# Altium schematic sheet ESP32_Interface.SchDoc
size A4; SheetNumber: 1; SheetTotal: 4
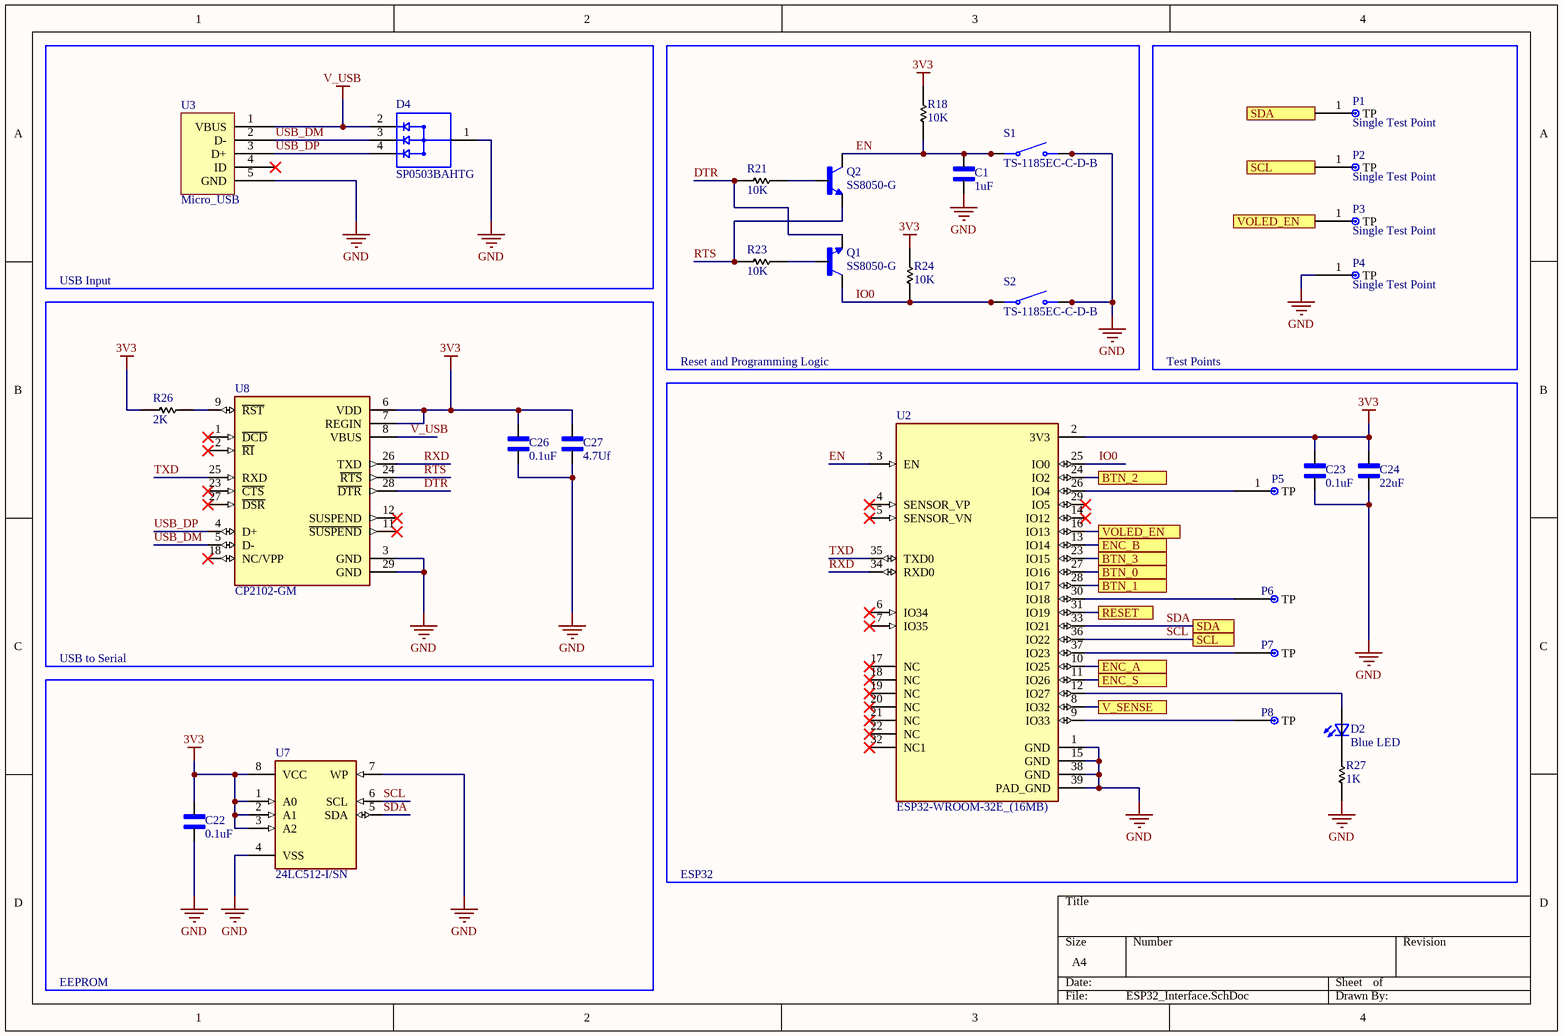
[diagram p0: ESP32_Interface.SchDoc]

## Parts
C1  1uF  [CHIP_0603]
C22  0.1uF  [CHIP_0603]
C23  0.1uF  [CHIP_0603]
C24  22uF  [CHIP_0603]
C26  0.1uF  [CHIP_0603]
C27  4.7Uf  [CHIP_0603]
D2  Blue LED  [0603 LED Generic]
D4  SP0503BAHTG  [SP0503BAHTG]
P1  Single Test Point  [1 Solder Pad]
P2  Single Test Point  [1 Solder Pad]
P3  Single Test Point  [1 Solder Pad]
P4  Single Test Point  [1 Solder Pad]
P5  Single Test Point  [1 Solder Pad]  (value not drawn)
P6  Single Test Point  [1 Solder Pad]  (value not drawn)
P7  Single Test Point  [1 Solder Pad]  (value not drawn)
P8  Single Test Point  [1 Solder Pad]  (value not drawn)
Q1  SS8050-G  [SS8050-G]
Q2  SS8050-G  [SS8050-G]
R18  10K  [CHIP_R_0603]
R21  10K  [CHIP_R_0603]
R23  10K  [CHIP_R_0603]
R24  10K  [CHIP_R_0603]
R26  2K  [CHIP_R_0603]
R27  1K  [CHIP_R_0603]
S1  TS-1185EC-C-D-B  [TS-1185EC-C-D-B]
S2  TS-1185EC-C-D-B  [TS-1185EC-C-D-B]
U2  ESP32-WROOM-32E_(16MB)  [MODULE_ESP32-WROOM-32E]
U3  Micro_USB  [U254-051T-4BH83-F1S]
U7  24LC512-I/SN  [24LC512-I/SN]
U8  CP2102-GM  [QFN50P500X500X100-29N]

## Blocks framed on the sheet
USB Input: D4 U3
Reset and Programming Logic: C1 Q1 Q2 R18 R21 R23 R24 S1 S2
Test Points: P1-P4
USB to Serial: C26 C27 R26 U8
ESP32: C23 C24 D2 P5-P8 R27 U2

## Ports
BTN_0, BTN_1, BTN_2, BTN_3, ENC_A, ENC_B, ENC_S, RESET, SCL, SDA, V_SENSE, VOLED_EN

## Nets
3V3: C22.1 C23.1 C24.1 C26.1 C27.1 R18.1 R24.1 R26.2 U2.2(3V3) U7.1(A0) U7.2(A1) U7.3(A2) U7.8(VCC) U8.6(VDD) U8.7(REGIN)
GND: C1.2 C22.2 C23.2 C24.2 C26.2 C27.2 D4.1 P4.1(TP) R27.2 S1.3(NO) S1.4(NO) S2.3(NO) S2.4(NO) U2.1(GND) U2.15(GND) U2.38(GND) U2.39(PAD_GND) U3.5(GND) U7.4(VSS) U7.7(WP) U8.3(GND) U8.29(GND)
V_USB: D4.2 U3.1(VBUS) U8.8(VBUS)
BTN_0: U2.27(IO16) ; port BTN_0
BTN_1: U2.28(IO17) ; port BTN_1
BTN_2: U2.24(IO2) ; port BTN_2
BTN_3: U2.23(IO15) ; port BTN_3
DTR: Q1.2(E) R21.2 U8.28(~{DTR})
EN: C1.1 Q2.3(C) R18.2 S1.1(COM) S1.2(COM) U2.3(EN)
ENC_A: U2.10(IO25) ; port ENC_A
ENC_B: U2.13(IO14) ; port ENC_B
ENC_S: U2.11(IO26) ; port ENC_S
IO0: Q1.3(C) R24.2 S2.1(COM) S2.2(COM) U2.25(IO0)
RESET: U2.31(IO19) ; port RESET
RTS: Q2.2(E) R23.2 U8.24(~{RTS})
RXD: U2.34(RXD0) U8.26(TXD)
SCL: P2.1(TP) U2.36(IO22) U7.6(SCL) ; port SCL
SDA: P1.1(TP) U2.33(IO21) U7.5(SDA) ; port SDA
TXD: U2.35(TXD0) U8.25(RXD)
USB_DM: D4.3 U3.2(D-) U8.5(D-)
USB_DP: D4.4 U3.3(D+) U8.4(D+)
V_SENSE: U2.8(IO32) ; port V_SENSE
VOLED_EN: P3.1(TP) U2.16(IO13) ; port VOLED_EN
NetD2_1: D2.1(K2) R27.1
NetD2_2: D2.2(A2) U2.12(IO27)
NetP5_1: P5.1(TP) U2.26(IO4)
NetP6_1: P6.1(TP) U2.30(IO18)
NetP7_1: P7.1(TP) U2.37(IO23)
NetP8_1: P8.1(TP) U2.9(IO33)
NetQ1_1: Q1.1(B) R23.1
NetQ2_1: Q2.1(B) R21.1
NetR26_1: R26.1 U8.9(~{RST})

Not connected (* = marked no-connect by the designer): U2 4(SENSOR_VP)* 5(SENSOR_VN)* 6(IO34)* 7(IO35)* 14(IO12)* 17(NC)* 18(NC)* 19(NC)* 20(NC)* 21(NC)* 22(NC)* 29(IO5)* 32(NC1)*; U3 4(ID)*; U8 1(~{DCD})* 2(~{RI})* 11(~{SUSPEND})* 12(SUSPEND)* 18(NC/VPP)* 23(~{CTS})* 27(~{DSR})*

## Notes on the sheet
- EEPROM

## Library data of the parts
C1 C22-C24 C26 C27 = 0603 Ceramic Capacitor: Generic 0603 Ceramic Capacitor; MP: AC0402FR-071ML; MF: Yageo; Package: 1005 Yageo; SnapEDA_Link: https://www.snapeda.com/parts/AC0402FR-071ML/Yageo/view-part/940461/?ref=snap; Value: *; Mouser-Purchase-URL: https://snapeda.com/shop?store=Mouser&id=940461; DigiKey-Purchase-URL: https://snapeda.com/shop?store=DigiKey&id=940461
D2 = 0603 Generic LED: Value: *
D4 = SP0503BAHTG: 8.5V Clamp Ipp Tvs Diode Surface Mount SOT-143-4; MF: Littelfuse Inc.; MP: SP0503BAHTG; Package: SOT-143 Littelfuse; SnapEDA_Link: https://www.snapeda.com/parts/SP0503BAHTG/Littelfuse%20Inc./view-part/214427/?ref=snap; Digi-Key_Purchase_URL: https://www.digikey.com/product-detail/en/littelfuse-inc/SP0503BAHTG/F2715CT-ND/1154322?utm_source=snapeda&utm_medium=aggregator&utm_campaign=symbol; Value: *; Digi-Key_Part_Number: F2715CT-ND
Q1 Q2 = SS8050-G: NPN TRANSISTOR 1.5A 40V SOT-23 R
R18 R21 R23 R24 R26 R27 = 0603 Generic Resistor: Generic 0603 Resistor
S1 S2 = TS-1185EC-C-D-B: SMD Tactile Switche - 3mm 2mm 50mA 3.65mm SPST 12V
U2 = ESP32-WROOM-32E_(16MB): Bluetooth, WiFi 802.11b/g/n, Bluetooth v4.2 +EDR, Class 1, 2 and 3 Transceiver Module 2.4GHz ~ 2.5GHz Integrated, Trace Surface Mount; MP: ESP32-WROOM-32E (16MB); MF: Espressif Systems; Value: *; SnapEDA_Link: https://www.snapeda.com/parts/ESP32-WROOM-32E%20(16MB)/Espressif%20Systems/view-part/4792564/?ref=snap; Check_prices: https://www.snapeda.com/parts/ESP32-WROOM-32E%20(16MB)/Espressif%20Systems/view-part/4792564/?ref=eda; Availability: Unavailable; Price: None; Package: None
U3 = Micro_USB: XKB Connectivity U254-051T-4BH83-F1S
U7 = 24LC512-I/SN: 512K I2C Serial EEPROM
U8 = CP2102-GM: USB Bridge, USB to UART USB 2.0 UART Interface 28-QFN _5x5_; MF: Silicon Labs; Package: QFN-28 Silicon Labs; Value: *; Price: None; MP: CP2102-GM; Availability: Unavailable; SnapEDA_Link: https://www.snapeda.com/parts/CP2102-GM/Silicon%20Labs/view-part/135876/?ref=snap